# EAGLE design chrono (EAGLE 7.5.0)
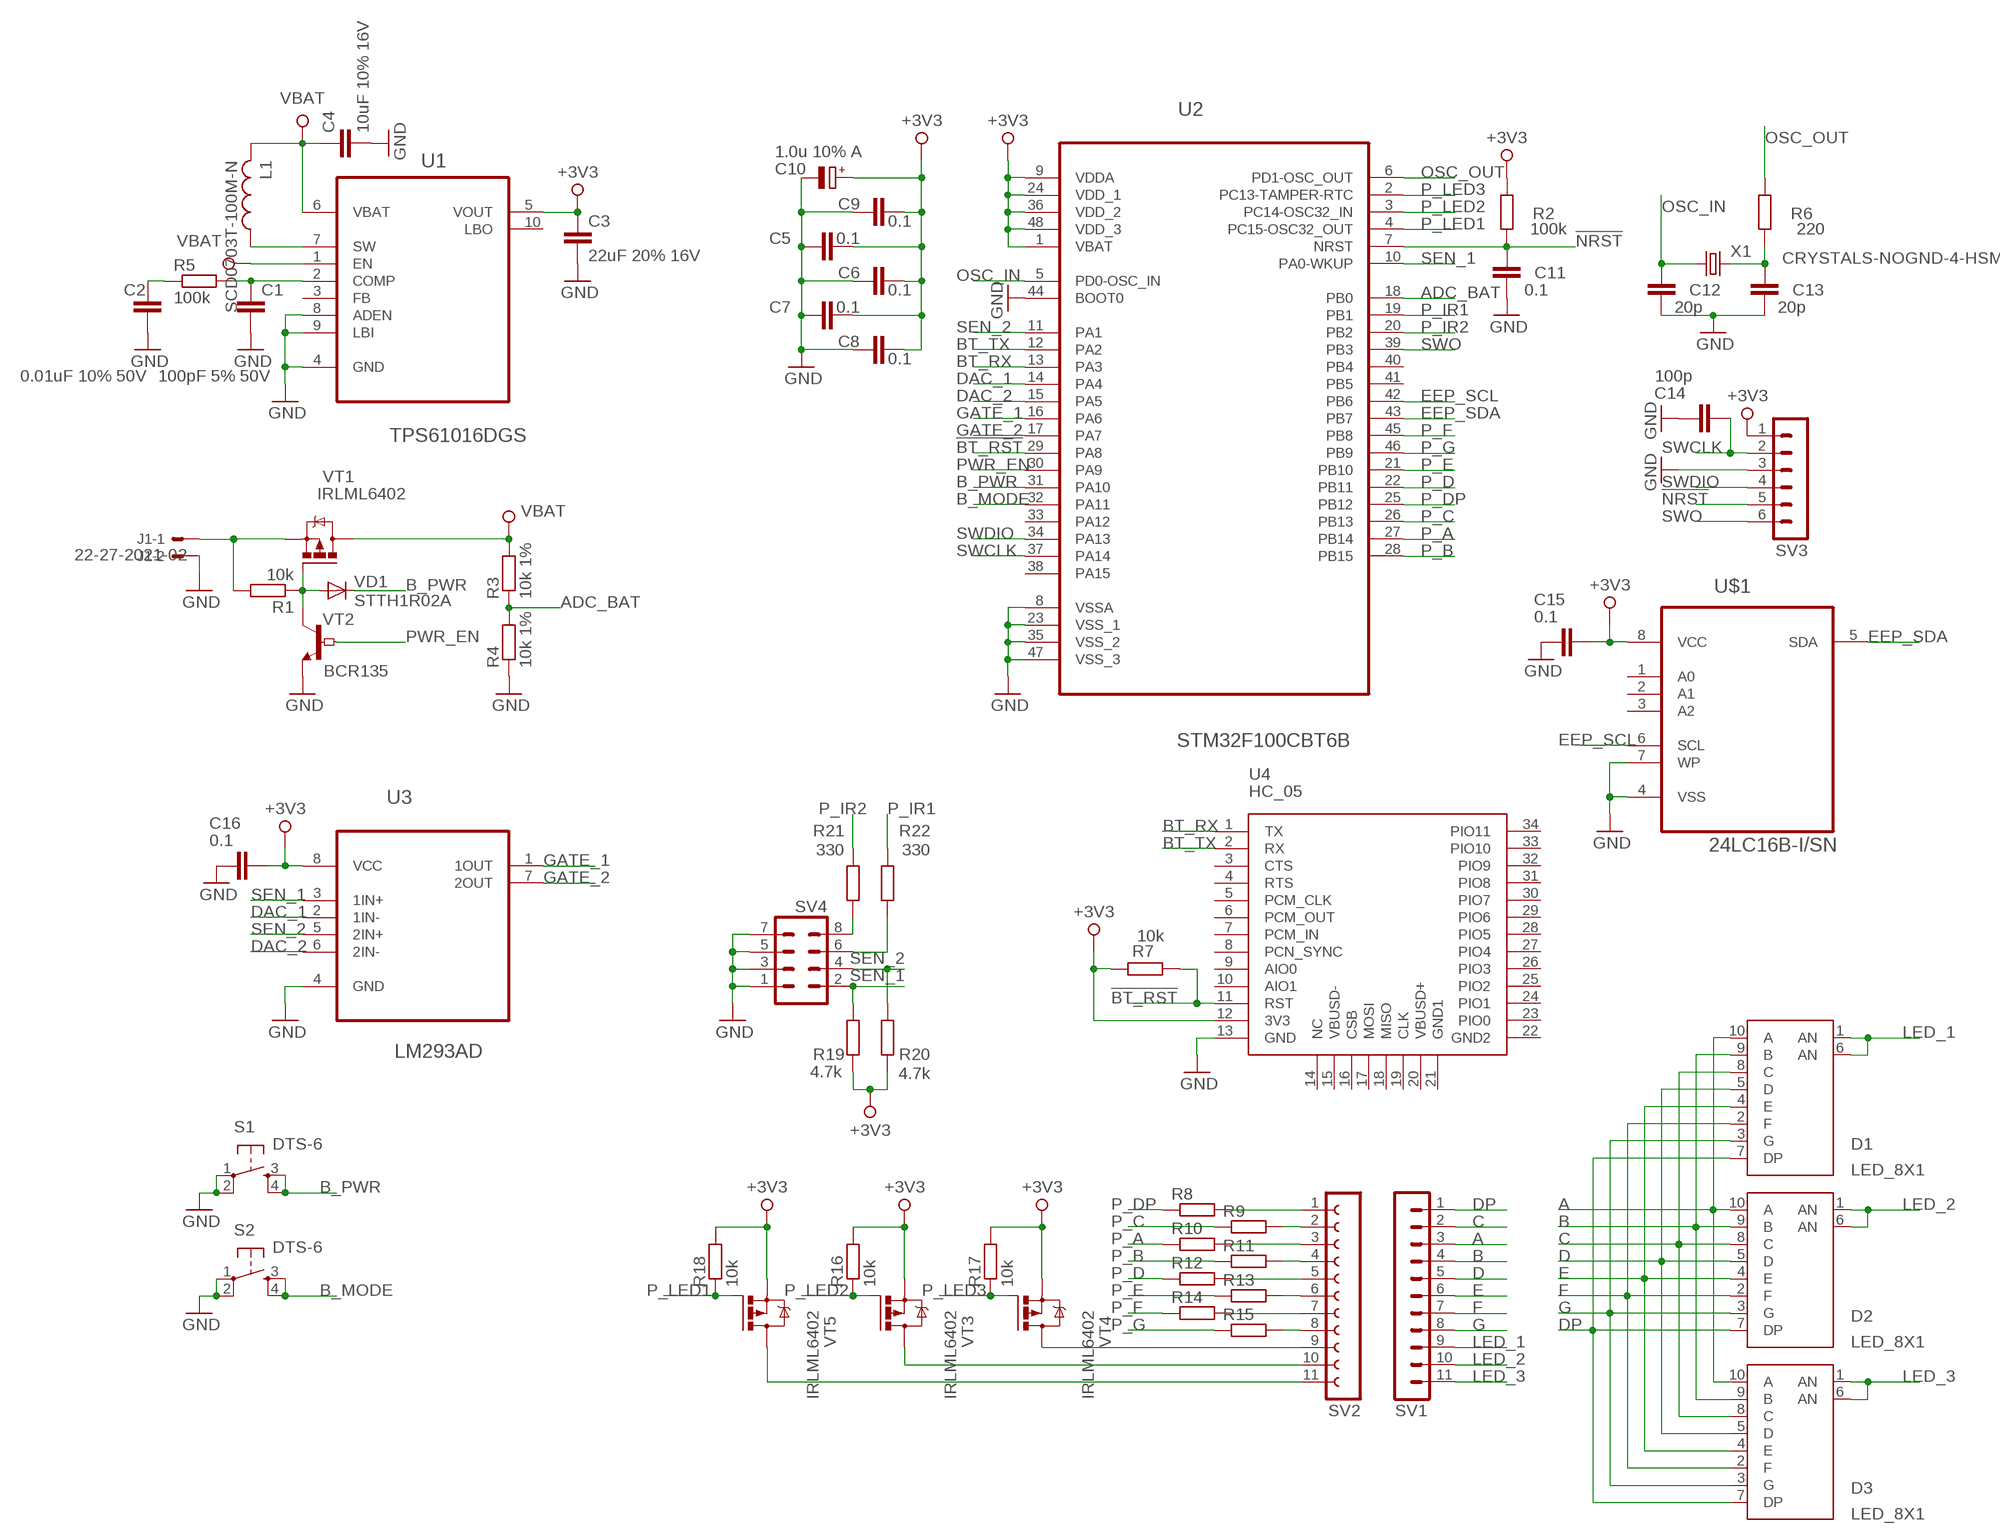
[diagram p0: schematic, sheet 1]

## Parts
C1  100pF 5% 50V  C-EUC0805  [C0805]
C2  0.01uF 10% 50V  C-EUC0805  [C0805]
C3  22uF 20% 16V  C-EUC1206  [C1206]
C4  10uF 10% 16V  C-EUC0805  [C0805]
C5  0.1  C-EUC0603  [C0603]
C6  0.1  C-EUC0603  [C0603]
C7  0.1  C-EUC0603  [C0603]
C8  0.1  C-EUC0603  [C0603]
C9  0.1  C-EUC0603  [C0603]
C10  1.0u 10% A  CPOL-EUSMCA  [SMC_A]
C11  0.1  C-EUC0603  [C0603]
C12  20p  C-EUC0603  [C0603]
C13  20p  C-EUC0603  [C0603]
C14  100p  C-EUC0603  [C0603]
C15  0.1  C-EUC0603  [C0603]
C16  0.1  C-EUC0603  [C0603]
D1  LED_8X1  [LED_DIP10]
D2  LED_8X1  [LED_DIP10]
D3  LED_8X1  [LED_DIP10]
J1  22-27-2021-02  [6410-02]
L1  SCD0703T-100M-N  L-US  [SCD0703]
R1  10k  R-EU_R0805  [R0805]
R2  100k  R-EU_R0603  [R0603]
R3  10k 1%  R-EU_R0603  [R0603]
R4  10k 1%  R-EU_R0603  [R0603]
R5  100k  R-EU_R0805  [R0805]
R6  220  R-EU_R0603  [R0603]
R7  10k  R-EU_R0603  [R0603]
R8  R-EU_R0603  [R0603]
R9  R-EU_R0603  [R0603]
R10  R-EU_R0603  [R0603]
R11  R-EU_R0603  [R0603]
R12  R-EU_R0603  [R0603]
R13  R-EU_R0603  [R0603]
R14  R-EU_R0603  [R0603]
R15  R-EU_R0603  [R0603]
R16  10k  R-EU_R0603  [R0603]
R17  10k  R-EU_R0603  [R0603]
R18  10k  R-EU_R0603  [R0603]
R19  4.7k  R-EU_R0603  [R0603]
R20  4.7k  R-EU_R0603  [R0603]
R21  330  R-EU_R0603  [R0603]
R22  330  R-EU_R0603  [R0603]
S1  DTS-6  [DTS-6]
S2  DTS-6  [DTS-6]
SV1  MA11-1W  [MA11-1W]
SV2  FE11-1  [FE11]
SV3  MA06-1  [MA06-1]
SV4  MA04-2  [MA04-2]
U1  TPS61016DGS  [SOP50P490X110-10N]
U2  STM32F100CBT6B  [QFP50P900X900X160-48N]
U3  LM293AD  [SOIC127P600X175-8N]
U4  HC_05  [BLUETOOTH_SMD]
U$1  24LC16B-I/SN  [SOIC127P600X175-8N]
VD1  STTH1R02A  VD-SMA  [SMA]
VT1  IRLML6402  [MICRO3]
VT2  BCR135  VT_NPN_DIGITAL  [SOT23-BEC]
VT3  IRLML6402  [MICRO3]
VT4  IRLML6402  [MICRO3]
VT5  IRLML6402  [MICRO3]
X1  CRYSTALS-NOGND-4-HSMX  [HC49-4-HSMX]

## Nets
!BT_RST: R7.2 U2.29(PA8) U4.11(RST)
!NRST: C11.1 R2.2 SV3.5 U2.7(NRST)
+3V3: C3.1 C5.2 C6.2 C7.2 C8.2 C9.1 C10.+ C15.2 C16.2 R2.1 R7.1 R16.2 R17.2 R18.2 R19.1 R20.1 SV3.1 U1.5(VOUT) U2.1(VBAT) U2.9(VDDA) U2.24(VDD_1) U2.36(VDD_2) U2.48(VDD_3) U3.8(VCC) U4.12(3V3) U$1.8(VCC) VT3.2(S) VT4.2(S) VT5.2(S)
A: D1.10(A) D2.10(A) D3.10(A) SV1.3
ADC_BAT: R3.1 R4.2 U2.18(PB0)
B: D1.9(B) D2.9(B) D3.9(B) SV1.4
B_MODE: S2.3 S2.4 U2.32(PA11)
B_PWR: S1.3 S1.4 U2.31(PA10) VD1.C
BT_RX: U2.13(PA3) U4.1(TX)
BT_TX: U2.12(PA2) U4.2(RX)
C: D1.8(C) D2.8(C) D3.8(C) SV1.2
D: D1.5(D) D2.5(D) D3.5(D) SV1.5
DAC_1: U2.14(PA4) U3.2(1IN-)
DAC_2: U2.15(PA5) U3.6(2IN-)
DP: D1.7(DP) D2.7(DP) D3.7(DP) SV1.1
E: D1.4(E) D2.4(E) D3.4(E) SV1.6
EEP_SCL: U2.42(PB6) U$1.6(SCL)
EEP_SDA: U2.43(PB7) U$1.5(SDA)
F: D1.2(F) D2.2(F) D3.2(F) SV1.7
G: D1.3(G) D2.3(G) D3.3(G) SV1.8
GATE_1: U2.16(PA6) U3.1(1OUT)
GATE_2: U2.17(PA7) U3.7(2OUT)
GND: C1.2 C2.2 C3.2 C4.2 C5.1 C6.1 C7.1 C8.1 C9.2 C10.- C11.2 C12.2 C13.2 C14.1 C15.1 C16.1 J1.2 R4.1 S1.1 S1.2 S2.1 S2.2 SV3.3 SV4.1 SV4.3 SV4.5 SV4.7 U1.4(GND) U1.8(ADEN) U1.9(LBI) U2.8(VSSA) U2.23(VSS_1) U2.35(VSS_2) U2.44(BOOT0) U2.47(VSS_3) U3.4(GND) U4.13(GND) U$1.4(VSS) U$1.7(WP) VT2.E
LED_1: D1.1(AN) D1.6(AN) SV1.9
LED_2: D2.1(AN) D2.6(AN) SV1.10
LED_3: D3.1(AN) D3.6(AN) SV1.11
N$1: J1.1 R1.2 VT1.2(S)
N$2: R1.1 VD1.A VT1.1(G) VT2.C
N$3: C1.1 R5.2 U1.2(COMP)
N$4: L1.P$1 U1.7(SW)
N$5: C2.1 R5.1
N$6: C13.1 R6.2 X1.2
N$7: R8.2 SV2.1
N$8: R9.2 SV2.2
N$9: R10.2 SV2.3
N$10: R11.2 SV2.4
N$21: R21.1 SV4.8
N$22: R12.2 SV2.5
N$23: R13.2 SV2.6
N$24: R14.2 SV2.7
N$25: R15.2 SV2.8
N$26: SV2.9 VT4.3(D)
N$27: SV2.10 VT3.3(D)
N$28: SV2.11 VT5.3(D)
N$29: R22.1 SV4.6
OSC_IN: C12.1 U2.5(PD0-OSC_IN) X1.1
OSC_OUT: R6.1 U2.6(PD1-OSC_OUT)
P_A: R10.1 U2.27(PB14)
P_B: R11.1 U2.28(PB15)
P_C: R9.1 U2.26(PB13)
P_D: R12.1 U2.22(PB11)
P_DP: R8.1 U2.25(PB12)
P_E: R13.1 U2.21(PB10)
P_F: R14.1 U2.45(PB8)
P_G: R15.1 U2.46(PB9)
P_IR1: R22.2 U2.19(PB1)
P_IR2: R21.2 U2.20(PB2)
P_LED1: R18.1 U2.4(PC15-OSC32_OUT) VT5.1(G)
P_LED2: R16.1 U2.3(PC14-OSC32_IN) VT3.1(G)
P_LED3: R17.1 U2.2(PC13-TAMPER-RTC) VT4.1(G)
PWR_EN: U2.30(PA9) VT2.B
SEN_1: R19.2 SV4.2 U2.10(PA0-WKUP) U3.3(1IN+)
SEN_2: R20.2 SV4.4 U2.11(PA1) U3.5(2IN+)
SWCLK: C14.2 SV3.2 U2.37(PA14)
SWDIO: SV3.4 U2.34(PA13)
SWO: SV3.6 U2.39(PB3)
VBAT: C4.1 L1.P$2 R3.2 U1.1(EN) U1.6(VBAT) VT1.3(D)
Unconnected: U1.3(FB) U1.10(LBO) U2.33(PA12) U2.38(PA15) U2.40(PB4) U2.41(PB5) U4.3(CTS) U4.4(RTS) U4.5(PCM_CLK) U4.6(PCM_OUT) U4.7(PCM_IN) U4.8(PCN_SYNC) U4.9(AIO0) U4.10(AIO1) U4.14(NC) U4.15(VBUSD-) U4.16(CSB) U4.17(MOSI) U4.18(MISO) U4.19(CLK) U4.20(VBUSD+) U4.21(GND1) U4.22(GND2) U4.23(PIO0) U4.24(PIO1) U4.25(PIO2) U4.26(PIO3) U4.27(PIO4) U4.28(PIO5) U4.29(PIO6) U4.30(PIO7) U4.31(PIO8) U4.32(PIO9) U4.33(PIO10) U4.34(PIO11) U$1.1(A0) U$1.2(A1) U$1.3(A2)

## Library data of the parts
C1-C9 C11-C16 = rcl:C-EU: CAPACITOR, European symbol
C10 = rcl:CPOL-EU: POLARIZED CAPACITOR, European symbol
D1-D3 = chrono:LED_8X1: edit this description Auto generated by make-symbol-device-package-bsdl.ulp Rev. 44 Source:
J1 = con-molex:22-?-02: CONNECTOR wire to board 2.54 mm (.1 inch) pitch header; OC_FARNELL: unknown; OC_NEWARK: unknown
L1 = chrono:L-US: INDUCTOR, American symbol
R1-R22 = rcl:R-EU_: RESISTOR, European symbol
S1 S2 = switch-tact:DTS-6
SV1 = chrono:MA11-1W: PIN HEADER; OC_FARNELL: unknown; OC_NEWARK: unknown
SV2 = chrono:FE11-1: FEMALE HEADER; OC_FARNELL: unknown; OC_NEWARK: unknown
SV3 = con-lstb:MA06-1: PIN HEADER; OC_FARNELL: unknown; OC_NEWARK: unknown
SV4 = con-lstb:MA04-2: PIN HEADER; OC_FARNELL: unknown; OC_NEWARK: unknown
U1 = Texas Instruments_By_element14_Batch_1:TPS61016DGS: 1-CELL AND 2-CELL BOOST CONVERTERS; MPN: TPS61016DGS; OC_FARNELL: 8457816; OC_NEWARK: 77C0668; PACKAGE: MSOP-10; SUPPLIER: Texas Instruments
U2 = ST Microelctronics_By_element14_Batch_1:STM32F100CBT6B: ARM-based 32-bit MCU; MPN: STM32F100CBT6B; OC_FARNELL: 1838512; OC_NEWARK: 86R1308; PACKAGE: LQFP-48; SUPPLIER: STMircroelectronics
U3 = Texas Instruments_By_element14_Batch_1:LM293AD: DUAL DIFFERENTIAL COMPARATORS; MPN: LM293AD; OC_FARNELL: 8389225; OC_NEWARK: 38K3696; PACKAGE: SOIC-8; SUPPLIER: TI
U4 = SerialPortBluetooth:HC_05
U$1 = Microchip_By_element14_Batch_1:24LC16B-I/SN: 16K I2C Serial EEPROM; MPN: 24LC16B-I/SN; OC_FARNELL: 1296575; OC_NEWARK: 69K7670; PACKAGE: SOIC-8; SUPPLIER: MICROCHIP
VD1 = walkgeek-eagle:VD-SMA
VT1 VT3-VT5 = walkgeek-eagle:IRLML6402: HEXFET P-Channel Power MOSFET
VT2 = walkgeek-eagle:VT_NPN_DIGITAL
X1 = IQD-Frequency-Products:CRYSTALS-NOGND: CRYSTALS CAN NOT GROUNDED

## Board
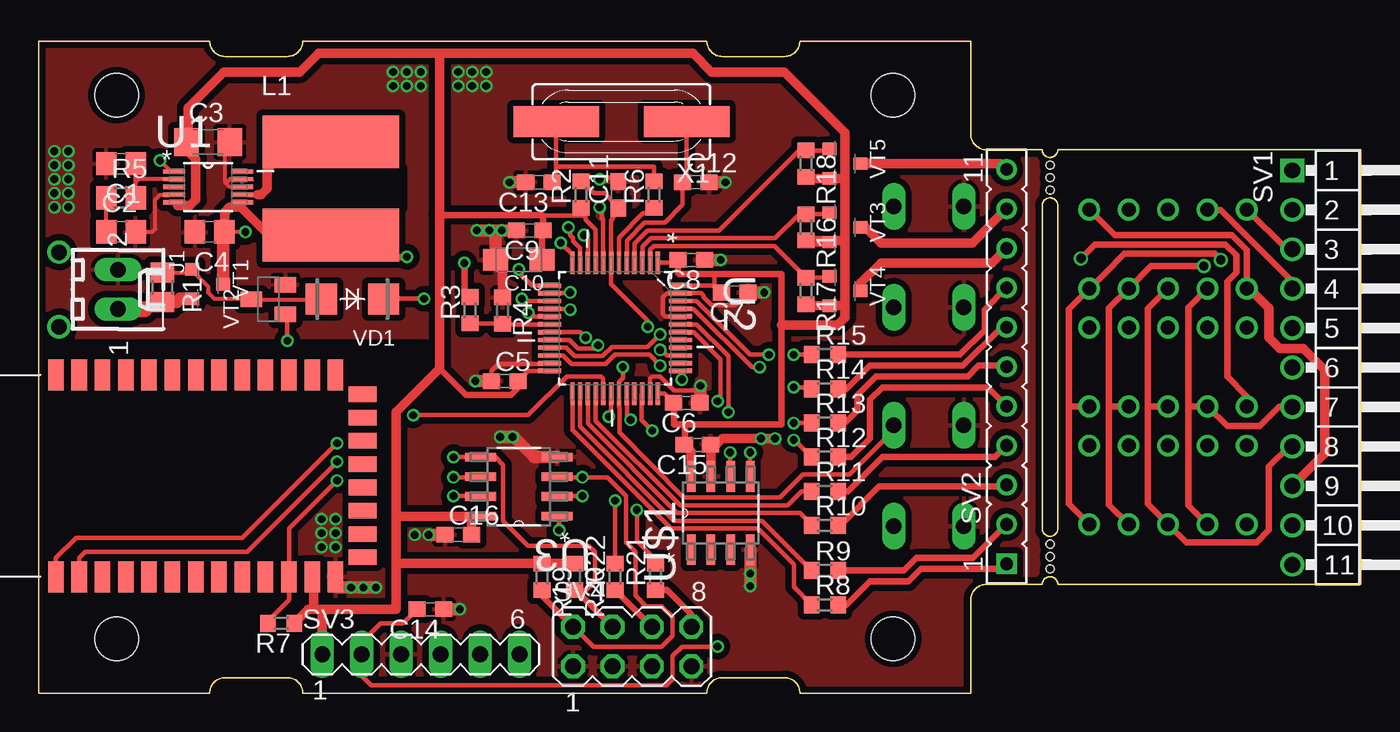
[diagram p1: board, top side]
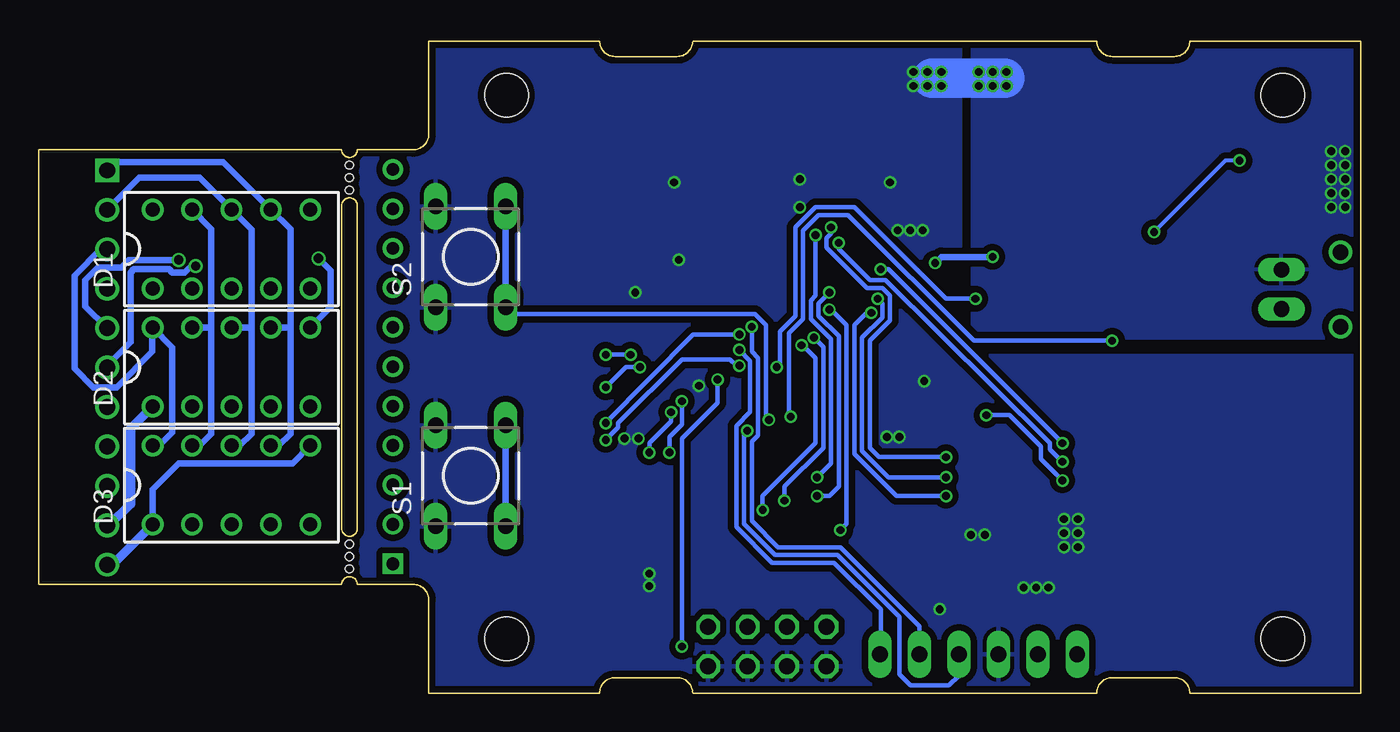
[diagram p2: board, bottom side, seen from below]

Size 85.1 x 42 mm. Coordinates in mm from the lower left corner, seen from the top.
Outline: 64.6,31.4 64.6,10.6 arc180 65.6,10.6 65.6,31.4 arc180 64.6,31.4
Outline: 0,0 0,42 11,42 arc90 12,41 16,41 arc90 17,42 43,42 arc90 44,41 48,41 arc90 49,42 60,42 60,36 arc90 61,35 64.6,35 arc180 65.6,35 85.1,35 85.1,7 65.6,7 arc180 64.6,7 61,7 arc90 60,6 60,0 49,0 arc90 48,1 44,1 arc90 43,0 17,0 arc90 16,1 12,1 arc90 11,0 0,0
Copper layers (1*16): Top 0.035mm / dielectric 1.5mm / Bottom 0.035mm
Design rules "dirt_cheap_dirty_boards.v1": minimum track width 5mil, minimum drill 12mil, track to track 5mil, track to pad 5mil, pad to pad 5mil, via to via 5mil, smd to smd 0mil, copper to edge 10mil, drill to drill 10mil, minimum pad ring 10mil, minimum via ring 6mil, stop-mask expansion 2mil, vias tented up to drill 25mil, thermal gap 10mil
Holes 2.8 mm at 5,38.5 5,3.5 55,38.5 55,3.5
Holes 0.5 mm at 65.1,34 65.1,33.2 65.1,32.4 65.1,8 65.1,8.8 65.1,9.6

### Footprints (pad centres in the part's own frame; a part is rotated, then mirrored left to right if it is on the bottom)
C0805 = smd 1.3 x 1.5: 1 -0.95,0; 2 0.95,0
C1206 = smd 1.6 x 1.8: 1 -1.4,0; 2 1.4,0
C0603 = smd 1.1 x 1: 1 -0.85,0; 2 0.85,0
SMC_A = smd 1.6 x 1.4: + -1.5,0; - 1.5,0
LED_DIP10 = drill 0.9 pad 1.4: 1 -2.54,5.08; 2 -2.54,2.54; 3 -2.54,0; 4 -2.54,-2.54; 5 -2.54,-5.08; 6 2.54,-5.08; 7 2.54,-2.54; 8 2.54,0; 9 2.54,2.54; 10 2.54,5.08
6410-02 = drill 1.016 long: 1 1.27,0; 2 -1.27,0
SCD0703 = smd 8.8 x 3.4: P$1 0,3; P$2 0,-3
R0805 = smd 1.3 x 1.5: 1 -0.95,0; 2 0.95,0
R0603 = smd 1 x 1.1: 1 -0.85,0; 2 0.85,0
DTS-6 = drill 1 long: 1 -3.25,2.25; 2 3.25,2.25; 3 -3.25,-2.25; 4 3.25,-2.25
MA11-1W = drill 1.016 square: 1 -13.97,0 | drill 1.016: 2 -11.43,0; 3 -8.89,0; 4 -6.35,0; 5 -3.81,0; 6 -1.27,0; 7 1.27,0; 8 3.81,0; 9 6.35,0; 10 8.89,0; 11 11.43,0
FE11 = drill 0.813 square: 1 -13.97,0 | drill 0.813: 2 -11.43,0; 3 -8.89,0; 4 -6.35,0; 5 -3.81,0; 6 -1.27,0; 7 1.27,0; 8 3.81,0; 9 6.35,0; 10 8.89,0; 11 11.43,0
MA06-1 = drill 1.016 long: 1 -6.35,0; 2 -3.81,0; 3 -1.27,0; 4 1.27,0; 5 3.81,0; 6 6.35,0
MA04-2 = drill 1.016 octagon: 1 -3.81,-1.27; 2 -3.81,1.27; 3 -1.27,-1.27; 4 -1.27,1.27; 5 1.27,-1.27; 6 1.27,1.27; 7 3.81,-1.27; 8 3.81,1.27
SOP50P490X110-10N = smd 1.422 x 0.279: 1 -2.184,0.991; 2 -2.184,0.508; 3 -2.184,0; 4 -2.184,-0.508; 5 -2.184,-0.991; 6 2.184,-0.991; 7 2.184,-0.508; 8 2.184,0; 9 2.184,0.508; 10 2.184,0.991
QFP50P900X900X160-48N = smd 1.473 x 0.279: 1 -4.216,2.743; 2 -4.216,2.261; 3 -4.216,1.753; 4 -4.216,1.245; 5 -4.216,0.762; 6 -4.216,0.254; 7 -4.216,-0.254; 8 -4.216,-0.762; 9 -4.216,-1.245; 10 -4.216,-1.753; 11 -4.216,-2.261; 12 -4.216,-2.743; 25 4.216,-2.743; 26 4.216,-2.261; 27 4.216,-1.753; 28 4.216,-1.245; 29 4.216,-0.762; 30 4.216,-0.254; 31 4.216,0.254; 32 4.216,0.762; 33 4.216,1.245; 34 4.216,1.753; 35 4.216,2.261; 36 4.216,2.743 | smd 0.279 x 1.473: 13 -2.743,-4.216; 14 -2.261,-4.216; 15 -1.753,-4.216; 16 -1.245,-4.216; 17 -0.762,-4.216; 18 -0.254,-4.216; 19 0.254,-4.216; 20 0.762,-4.216; 21 1.245,-4.216; 22 1.753,-4.216; 23 2.261,-4.216; 24 2.743,-4.216; 37 2.743,4.216; 38 2.261,4.216; 39 1.753,4.216; 40 1.245,4.216; 41 0.762,4.216; 42 0.254,4.216; 43 -0.254,4.216; 44 -0.762,4.216; 45 -1.245,4.216; 46 -1.753,4.216; 47 -2.261,4.216; 48 -2.743,4.216
SOIC127P600X175-8N = smd 1.981 x 0.559: 1 -2.464,1.905; 2 -2.464,0.635; 3 -2.464,-0.635; 4 -2.464,-1.905; 5 2.464,-1.905; 6 2.464,-0.635; 7 2.464,0.635; 8 2.464,1.905
BLUETOOTH_SMD = smd 2 x 1: 1 0,0; 2 0,-1.5; 3 0,-3; 4 0,-4.5; 5 0,-6; 6 0,-7.5; 7 0,-9; 8 0,-10.5; 9 0,-12; 10 0,-13.5; 11 0,-15; 12 0,-16.5; 13 0,-18; 22 13,-18; 23 13,-16.5; 24 13,-15; 25 13,-13.5; 26 13,-12; 27 13,-10.5; 28 13,-9; 29 13,-7.5; 30 13,-6; 31 13,-4.5; 32 13,-3; 33 13,-1.5; 34 13,0 | smd 1 x 1.8: 14 1.25,-19.75; 15 2.75,-19.75; 16 4.25,-19.75; 17 5.75,-19.75; 18 7.25,-19.75; 19 8.75,-19.75; 20 10.25,-19.75; 21 11.75,-19.75
SOIC127P600X175-8N' = smd 1.981 x 0.559: 1 -2.362,1.905; 2 -2.362,0.635; 3 -2.362,-0.635; 4 -2.362,-1.905; 5 2.362,-1.905; 6 2.362,-0.635; 7 2.362,0.635; 8 2.362,1.905
SMA = smd 2 x 2: A 2,0; C -2,0
MICRO3 = smd 0.8 x 0.9: 1 -0.95,-1; 2 0.95,-1; 3 0,1
SOT23-BEC = smd 1 x 1.4: B -0.95,-1.1; C 0,1.1; E 0.95,-1.1
HC49-4-HSMX = smd 5.5 x 2: 1 -4.2,0; 2 4.2,0

### Placement (x,y rotation side)
C1  5.3,34.1 180 top
C2  5.3,29.7 0 top
C3  10.9,35.5 0 top
C4  11,29.7 180 top
C5  30,20.1 0 top
C6  41.7,18.7 180 top
C7  44.8,25.8 180 top
C8  42,27.9 180 top
C9  31.6,29.8 180 top
C10  30.9,27.9 180 top
C11  37.3,32.1 90 top
C12  42.3,32.9 0 top
C13  32.2,32.9 180 top
C14  25.2,5.4 180 top
C15  42.4,16 180 top
C16  27,10.2 0 top
D1  72.7,28.6 90 bottom
D2  72.7,21 90 bottom
D3  72.7,13.4 90 bottom
J1  5.1,26 270 top
L1  18.8,32.5 0 top
R1  7.95,26.14 270 top
R2  34.9,32.1 90 top
R3  27.76,24.66 90 top
R4  29.86,24.64 270 top
R5  5.3,31.9 0 top
R6  39.6,32.1 90 top
R7  15.6,4.5 180 top
R8  50.6,5.7 0 top
R9  50.6,7.9 0 top
R10  50.6,10.8 0 top
R11  50.6,13 0 top
R12  50.6,15.2 0 top
R13  50.6,17.4 0 top
R14  50.6,19.6 0 top
R15  50.6,21.8 0 top
R16  49.4,30 270 top
R17  49.4,25.9 270 top
R18  49.4,34.1 270 top
R19  32.4,7.5 270 top
R20  34.5,7.5 270 top
R21  39.7,7.5 90 top
R22  37.1,7.5 90 top
S1  57.3,14 90 bottom
S2  57.3,28.1 90 bottom
SV1  80.7,19.7 270 top
SV2  62.3,22.3 90 top
SV3  24.6,2.5 0 top
SV4  38.2,3 0 top
U1  10.9,32.6 0 top
U2  37.1,23.5 270 top
U3  30.9,13.3 180 top
U4  1.1,7.5 90 top
U$1  24LC16B-I/SN  [SOIC127P600X175-8N']  43.9,11.6 90 top
VD1  20.19,25.38 180 top
VT1  10.88,26.34 270 top
VT2  14.78,25.36 90 top
VT3  51.9,30 270 top
VT4  51.9,25.9 270 top
VT5  51.9,34.1 270 top
X1  37.5,36.8 180 top

### Tracks (layer width: path | path; a pad name or v marks a point on that pad's centre or on a via)
!BT_RST  (via drill 0.5)
  Top 0.305: U2.29 36.34,20.26 36.2,20.4 34,20.4 31.5,17.9 v24.1,17.9 | v19.2,13.7 16.1,10.6 U4.11 16.1,6 14.75,4.65 R7.2
  Bottom 0.305: v24.1,17.9 22.6,17.9 20.6,15.9 20.6,15.1 v19.2,13.7
!NRST  (via drill 0.5)
  Top 0.305: R2.2 35.75,32.2 36.5,32.2 37.3,31.1 C11.1 36.85,30.4 U2.7 36.85,26.35 39.2,24 v39.2,23.6
  Bottom 0.305: SV3.5 28.41,4.31 33.5,9.4 37.5,9.4 39.2,11.1 39.2,16.2 38.8,16.6 38.8,21.6 39.2,22 v39.2,23.6
+3V3
  Top 0.254: U1.5 8.93,31.4
  Top 0.305: U2.9 35.85,29.84 35.2,30.5 35.2,30.7 | U2.1 40.97,27.72 C8.2 | U2.24 31.51,20.76 C5.2 | 35.2,30.7 35.2,30.95 R2.1 | 32.45,30.75 35.15,30.75 35.2,30.7 | U2.36 40.27,19.28 C6.2 | 43.6,26.15 C7.2 43.51,26.24 U2.48 43.46,26.24 43.5,26.2 43.5,27
  Top 0.406: 41.4,17.3 47.8,17.3 47.8,23.7 47.8,27 43.5,27 41.2,27 41.15,27.05 C8.2 | 41.4,17.3 40.9,17.3 40.9,18.65 | C10.+ 32.4,29.75 C9.1 32.45,30.75 32.4,30.8 25.8,30.8 25.8,30.9 | 41.6,16.05 41.6,17.1 41.4,17.3 | 25.8,20.9 27.5,19.2 30.4,19.2 30.85,19.65 C5.2
  Top 0.61: 8.93,31.4 9.7,31.4 10.1,31.8 10.1,34.4 9.5,35 C3.1 9.6,35.6 9.6,37.7 11.9,40 16.8,40 18,41.2 25.8,41.2 | 25.8,41.2 42.1,41.2 43.3,40 48,40 51.9,36.1 51.9,33.2 | 25.8,41.2 25.8,30.9 25.8,20.9 23,18.1 23,11.6 | 23,11.6 23,8.3 | 23,8.3 23,5.4 18.1,5.4 | 18.1,5.4 17.7,5.4 | 17.7,5.4 17.7,7.4 U4.12 | VT3.2 49.5,29.05 R16.2 51.65,29.15 51.9,28.9 | R18.2 49.5,33.15 VT5.2 51.85,33.15 51.9,33.2 | R17.2 49.5,24.95 VT4.2 51.85,24.95 51.9,25 | SV3.1 18.25,5.25 18.1,5.4 | 17.7,5.4 17.35,5.4 R7.1 | 51.9,33.2 51.9,28.9 | 51.9,28.9 51.9,25 | 51.9,25 51.9,24.2 51.4,23.7 47.8,23.7 | U3.8 27.7,11.39 | 23,8.3 23.05,8.35 R19.1 R20.1 | 40.9,18.65 C6.2 | 41.6,16.05 C15.2 41.99,15.55 U$1.8 | C16.2 27.85,11.24 27.7,11.39 | 27.7,11.39 23.2,11.39 23,11.6
A
  Top 0.406: 77.8,23.52 D2.10 | SV1.3 80.33,28.59 D1.10
  Bottom 0.406: D3.10 77.36,15.94 76.5,16.8 76.5,22.26 D2.10 77.8,23.52 77.8,22 80.1,19.7 81.6,19.7 82.8,20.9 82.8,26.9 81.11,28.59 SV1.3
ADC_BAT
  Top 0.305: U2.18 29.9,23.75 R4.2 27.78,23.79 R3.1
B
  Top 0.406: D1.9 75.28,31.1 76.1,31.1 80.7,26.5 SV1.4
  Bottom 0.406: D3.9 74.76,15.94 74,16.7 74,23.5 | 74,23.5 74,29.9 D1.9 | D2.9 74.04,23.54 74,23.5
B_MODE  (via drill 0.5)
  Top 0.305: U2.32 37.86,17.86 v38.1,17.6
  Bottom 0.305: v38.1,17.6 38.3,17.8 38.3,23.7 39,24.4 54.6,24.4 S2.3
  Bottom 0.406: S2.3 S2.4
B_PWR  (via drill 0.5)
  Top 0.305: S1.4 55.05,16.95 52.2,14.1 49.2,14.1 47.7,12.6 41.5,12.6 37.4,16.8 37.4,18.4 37.35,18.45 U2.31 37.35,20.05 37.6,20.3 v37.6,21 | v24.8,25.4 22.21,25.4 VD1.C
  Bottom 0.305: v37.6,21 37.4,21.2 37.4,23.3 36.4,24.3 36.4,30 35.1,31.3 32.6,31.3 26.7,25.4 v24.8,25.4
  Bottom 0.406: S1.3 S1.4
BT_RX  (via drill 0.5)
  Top 0.305: U2.13 31.76,26.24 30.9,27.1 v30.9,27.3 | U4.1 1.1,8.7 2.4,10 13.1,10 v19.2,16.1
  Bottom 0.305: 30.6,27.3 v30.9,27.3 30.4,27.3 v19.2,16.1
BT_TX  (via drill 0.5)
  Top 0.305: U2.12 34.36,28.24 v33.6,29 | 2.7,7.6 U4.2 2.6,8.7 3,9.1 13.4,9.1 v19.2,14.9
  Bottom 0.305: v33.6,29 33.6,28.6 31.6,26.6 30.6,26.6 20.1,16.2 20,16.1 20,15.7 v19.2,14.9
C
  Bottom 0.406: D3.8 72.16,15.94 71.4,16.7 71.4,23.4 | 71.4,23.4 71.4,29.84 D1.8 74.76,33.2 78.63,33.2 SV1.2 | D2.8 71.54,23.54 71.4,23.4
D  (via drill 0.6)
  Top 0.406: 66.3,18.4 66.3,24.74 D1.5 68.62,27.02 69.9,28.3 75.7,28.3 v76.1,27.9 | D2.5 66.36,18.46 66.3,18.4 | 66.3,18.4 66.3,12.18 D3.5
  Bottom 0.406: v76.1,27.9 79.3,27.9 79.8,27.4 81.3,27.4 82.1,26.6 82.1,24.91 SV1.5
DAC_1  (via drill 0.5)
  Top 0.305: U2.14 34.16,25.76 v34.2,25.8 | v35,12.7 33.4,12.7 U3.2
  Bottom 0.305: v34.2,25.8 34.9,25.1 34.9,24.3 33.6,23 33.6,13.3 34.2,12.7 v35,12.7
DAC_2  (via drill 0.5)
  Top 0.305: U2.15 31.25,25.25 v31.1,25.4 | v26.7,13.9 28.4,13.9 U3.6
  Bottom 0.305: v26.7,13.9 30.4,13.9 32.1,15.6 32.1,22.9 30.8,24.2 30.8,25.1 v31.1,25.4
DP
  Bottom 0.406: D3.7 69.66,15.94 68.9,16.7 68.9,23.4 | 68.9,23.4 68.9,29.88 D1.7 73.22,34.2 80.17,34.2 SV1.1 | D2.7 69.04,23.54 68.9,23.4
E  (via drill 0.6)
  Top 0.406: 68.9,18.5 68.9,24.8 D1.4 71.6,27.5 v75,27.5 | D2.4 68.94,18.46 68.9,18.5 | 68.9,18.5 68.9,12.12 D3.4
  Bottom 0.406: SV1.6 80.7,21.1 79.2,22.6 79.2,27.1 79,27.3 76.7,27.3 76.5,27.1 75.7,27.1 75.3,27.5 v75,27.5 75.1,27.5
EEP_SCL  (via drill 0.5)
  Top 0.305: U2.42 42.15,23.25 43.9,21.5 43.9,19 v43.7,18.8 | v44.5,15.5 44.5,14 U$1.6
  Bottom 0.305: v43.7,18.8 43.7,17.3 44.5,16.5 v44.5,15.5
EEP_SDA  (via drill 0.5)
  Top 0.305: U2.43 42.35,23.75 44.4,21.7 v44.4,18.1 | v45.8,15.5 U$1.5
  Bottom 0.305: 44.4,17.9 v44.4,18.1 44.4,17.5 45.8,16.1 v45.8,15.5
F
  Top 0.406: 74,18.3 74,24.82 D1.2 | 74,18.3 74.16,18.46 D2.2 76.5,17.2 78.6,17.2 79.83,18.43 SV1.7 | 74,18.3 74,12.1 D3.2
G
  Top 0.406: 71.4,18.3 71.4,12.2 72.7,10.9 D3.3 73.86,9.7 78.4,9.7 79.2,10.5 79.2,14.6 80.49,15.89 SV1.8 | 71.4,18.3 71.4,24.76 D1.3 | D2.3 71.56,18.46 71.4,18.3
GATE_1  (via drill 0.5)
  Top 0.305: U2.16 34.16,24.75 v34.2,24.7 | v33.5,10.5 33.5,11.26 U3.1
  Bottom 0.305: v34.2,24.7 34.1,24.7 33.1,23.7 33.1,10.9 v33.5,10.5
GATE_2  (via drill 0.5)
  Top 0.305: U2.17 31.74,24.26 v31.5,24.5 | v26.7,12.7 28.4,12.7 U3.7
  Bottom 0.305: v31.5,24.5 31.8,24.5 32.6,23.7 32.6,15.4 29.9,12.7 v26.7,12.7
GND  (via drill 0.5)
  Top 0.254: 11.9,35.1 C3.2 12,35.2 12,32.9 12.05,32.85 | C2.2 7.3,29.7 7.5,29.9 7.5,31.8 7.8,32.1 8.71,32.1 U1.4 | U1.8 12.3,32.6 12.05,32.85 | U1.9 12.31,33.11 12.05,32.85
  Top 0.305: U2.8 36.34,30.54 36.26,30.54 36.26,31.14 v36.1,31.3 | 37.45,32.95 C11.2 37.25,33.2 36.2,33.2 v36.1,33.1 | U2.44 40.34,24.26 40.2,24.4 40.2,25.5 40.46,25.76 U2.47 42.64,25.76 42.8,25.6 42.8,25.5 43.3,25 44.85,25 C7.1 | U2.23 32.84,21.2 29.6,21.2 29.15,20.75 C5.1 | U2.35 39.36,20.26 39.5,20.4 40,20.4 40.9,19.5 42.3,19.5 v42.6,19.8
  Top 0.61: R4.1 29.86,27.44 C10.- | U$1.7 43.27,15.98 C15.1 43.6,16 44,16.4 v46.5,16.4 v47.4,16.4 47.5,16.4 | C6.1 42.55,19.75 v42.6,19.8 | U4.13 19,7.5 18.9,7.4 18.9,7.2 19.3,6.8
  Top 0.813: 19.3,6.8 v20.1,6.8 v20.9,6.8 v21.7,6.8 | C10.- 29.4,29.7 29.5,29.8 v29.8,29.8 | C9.2 v29.8,29.8 | v29.8,29.8 v29,29.8 v28.2,29.8 | C13.2 v30.3,32.9 | C12.2 v44.2,32.9 | C8.1 v43.9,27.9 | 45.6,25.8 v46.7,25.8 | C6.1 42.6,18.75 v42.6,19.8 | C16.1 v25.1,10.2 | C14.1 v27.1,5.4 | C5.1 v28.1,20.1 | U$1.4 v45.8,6.91 v45.8,6.9 | U3.4 31.9,15.21 30.6,16.5 v30.5,16.5 v29.7,16.5
  Bottom 2.54: 22.9,39.6 27.6,39.6
  other vias: 45.8,7.7 22.8,40 23.7,40 24.6,40 22.8,39.1 23.7,39.1 24.6,39.1 27,40 27.9,40 28.8,40 27,39.1 27.9,39.1 28.8,39.1 1,34.9 1,34 1,33.1 1,32.2 1,31.3 1.9,34.9 1.9,34 1.9,33.1 1.9,32.2 1.9,31.3 19.1,9.4 19.1,10.3 19.1,11.2 18.2,11.2 18.2,10.3 18.2,9.4 24.2,10.2
  pour Bottom (isolate 0.406): 0.1,41.8 25,41.8 25,22.9 0.2,22.9
  pour Top (isolate 0.406): 0.1,41.8 25,41.8 25,22.9 0.2,22.9
  pour Bottom (isolate 0.406): 25.8,42 64.5,42 64.5,0 0.1,0 0.1,21.7 25.8,21.7
  pour Top (isolate 0.406): 25.5,42 64.5,42 64.5,0 0.1,0 0.1,21.7 25.5,21.7
  pour Top (isolate 0.406): 25.7,42 64.5,42 64.5,0 0.1,0 0.1,21.7 25.7,21.7
LED_1
  Top 0.406: D1.6 69.26,29.5 76.8,29.5 77.78,28.52 D1.1 77.94,26.06
  Top 0.61: 77.94,26.06 79.2,24.8 79.2,22.9 79.9,22.2 81.4,22.2 82.8,20.8 82.8,15.45 SV1.9
LED_2  (via drill 0.6)
  Top 0.406: D2.1 77.78,19.12 76.5,20.4 76.5,26.5 77.1,27.1 77.1,28.2 76.4,28.9 68,28.9 v67.1,28
  Bottom 0.406: v67.1,28 66.3,27.2 66.3,24.86 D2.6 | SV1.10 80.59,10.81
  Bottom 0.61: 80.59,10.81 79.2,12.2 79.2,17.04 D2.1
LED_3
  Bottom 0.406: D3.1 77.78,13.12 76.1,14.8 68.76,14.8 D3.6
  Bottom 0.61: SV1.11 80.37,8.27 D3.1
N$1
  Top 0.813: 6.81,24.71 7.3,25.2 R1.2 8.89,25.19 9.1,25.4 VT1.2
  Top 1.016: J1.1 6.79,24.73 6.81,24.71
N$2
  Top 0.254: R1.1 9.68,27.09 VT1.1 9.88,27.22 10.9,26.2 10.9,25.8 11.3,25.4 13.64,25.4 VT2.C 18.17,25.36 VD1.A
N$3
  Top 0.254: R5.2 6.25,32.9 | 6.25,32.9 C1.1 | 6.25,32.9 6.46,33.11 U1.2
N$4
  Top 0.254: 14.1,32.1 13.09,32.1 U1.7
  Top 0.61: L1.P$1 16.5,35.5 14.7,33.7 14.7,32.5 14.3,32.1 14.1,32.1
N$5
  Top 0.254: C2.1 R5.1
N$6
  Top 0.305: X1.2 33.3,33.8 | 33.3,33.8 33.3,32.85 C13.1 | R6.2 39.6,33.9 33.4,33.9 33.3,33.8
N$7
  Top 0.406: R8.2 52,5.7 53.5,7.2 56,7.2 56.8,8 61.97,8 SV2.1
N$8
  Top 0.406: R9.2 55.7,7.9 56.5,8.7 60.13,8.7 SV2.2
N$9
  Top 0.406: R10.2 51.6,10.8 54.1,13.3 62.19,13.3 SV2.3
N$10
  Top 0.406: R11.2 52.1,13 54.3,15.2 61.55,15.2 SV2.4
N$19  (via drill 1)
  other vias: 1.3,23.6
N$20  (via drill 1)
  other vias: 1.3,28.4
N$21
  Top 0.406: 39.63,6.65 R21.1 40.45,6.65 42,5.1 SV4.8
N$22
  Top 0.406: R12.2 52.3,15.2 53.5,16.4 53.5,18.9 54.3,19.7 61.09,19.7 SV2.5
N$23
  Top 0.406: SV2.6 62.23,21.1 60.5,21.1 59.8,20.4 53.9,20.4 52.7,19.2 52.7,18.2 52,17.5 51.5,17.5 51.45,17.45 R13.2
N$24
  Top 0.406: SV2.7 62.13,23.4 61.8,23.4 59.5,21.1 53.5,21.1 52,19.6 R14.2
N$25
  Top 0.406: R15.2 59.3,21.8 60.9,23.4 60.9,24.71 SV2.8
N$26
  Top 0.61: VT4.3 52.9,26.4 54.2,27.7 61.35,27.7 SV2.9
N$27
  Top 0.61: VT3.3 53.2,30 54.2,29 60.11,29 SV2.10
N$28
  Top 0.61: VT5.3 61.93,34.1 SV2.11
N$29
  Top 0.406: SV4.6 R22.1
OSC_IN
  Top 0.305: U2.5 37.86,29.16 39,30.3 40.3,30.3 41.45,31.45 C12.1 41.7,32.75 X1.1
OSC_OUT
  Top 0.305: U2.6 37.35,29.35 38.9,30.9 39.25,30.9 R6.1 39.65,30.9
P_A
  Top 0.305: U2.27 35.35,17.35 41.1,11.6 49,11.6 49.8,10.8 R10.1
P_B
  Top 0.305: U2.28 35.85,17.55 41.3,12.1 48.2,12.1 49.1,13 R11.1
P_C
  Top 0.305: U2.26 34.84,17.16 40.9,11.1 46.55,11.1 R9.1
P_D  (via drill 0.5)
  Top 0.305: U2.22 33.75,21.75 34.3,21.2 36.5,21.2 37.1,21.8 39.3,21.8 v40,21.1 | v48.6,16.3 48.65,16.3 R12.1
  Bottom 0.305: v48.6,16.3 47.8,17.1 47.8,17.4 43.7,21.5 40.6,21.5 40.2,21.1 v40,21.1
P_DP
  Top 0.305: U2.25 34.36,16.94 40.7,10.6 46.3,10.6 48.6,8.3 48.6,6.85 R8.1
P_E  (via drill 0.5)
  Top 0.305: U2.21 33.95,22.25 34.5,21.7 36.3,21.7 36.9,22.3 39.2,22.3 v40,23.1 | v48.6,17.4 R13.1
  Bottom 0.305: v40,23.1 43,23.1 v48.6,17.4
P_F  (via drill 0.5)
  Top 0.305: U2.45 42.16,24.75 45.9,21 v46.4,21 | v48.6,19.7 49.65,19.7 R14.1
  Bottom 0.305: v46.4,21 47.3,21 v48.6,19.7
P_G  (via drill 0.5)
  Top 0.305: U2.46 42.35,25.25 45.8,21.8 v47,21.8 | v48.6,21.8 R15.1
  Bottom 0.305: v47,21.8 v48.6,21.8
P_IR1  (via drill 0.5)
  Top 0.305: U2.19 34.85,23.25 v35.2,22.9 | v37.1,12.4 R22.2
  Bottom 0.305: v35.2,22.9 34.6,22.3 34.6,15.8 37.1,13.3 v37.1,12.4
P_IR2  (via drill 0.5)
  Top 0.305: U2.20 34.16,22.74 34.7,22.2 35.8,22.2 v36,22.4 | R21.2 39.7,8.6 38.5,9.8 v38.5,11.8
  Bottom 0.305: v36,22.4 35.9,22.4 35.1,21.6 35.1,16.1 38.5,12.7 v38.5,11.8
P_LED1
  Top 0.305: U2.4 38.34,28.95 39.2,29.8 43.8,29.8 48.9,34.9 49.35,34.9 R18.1 50.8,34.95 VT5.1
P_LED2
  Top 0.305: U2.3 38.85,28.75 39.4,29.3 47.4,29.3 48.9,30.8 49.35,30.8 R16.1 | 49.1,30.9 49.35,30.9 R16.1 | R16.1 50.8,30.85 VT3.1
P_LED3
  Top 0.305: U2.2 39.36,28.56 39.6,28.8 47.35,28.8 R17.1 50.8,26.75 VT4.1
PWR_EN  (via drill 0.5)
  Top 0.305: U2.30 36.85,17.95 v36.7,17.8 | v16,22.7 16,24.29 VT2.B
  Bottom 0.305: v16,22.7 24.9,22.7 33,30.8 34.9,30.8 35.9,29.8 35.9,24.1 36.8,23.2 36.8,17.9 v36.7,17.8
SEN_1  (via drill 0.5)
  Top 0.305: U2.10 35.35,29.25 v35.1,29.5 | U3.3 33.4,13.9 v35,13.9 36.6,13.9 37.8,12.7 37.8,9.7 38.4,9.1 38.4,6.3 39.1,5.6 40.1,5.6 40.8,4.9 40.8,3.7 40.1,3 35.7,3 34.43,4.27 SV4.2
  Top 0.406: R19.2 32.4,6.26 SV4.2
  Bottom 0.305: v35.1,29.5 35.1,25.6 35.4,25.3 35.4,24.1 34.1,22.8 34.1,14.8 v35,13.9
SEN_2  (via drill 0.5)
  Top 0.305: U2.11 34.84,28.66 34.4,29.1 34.4,29.3 34.2,29.5 34.2,29.9 v34.1,30 | v26.7,15.2 U3.5 29.4,15.2 29.9,14.7 29.9,11.1 31.5,9.5 35.4,9.5 35.8,9.1 35.8,7.2 35.25,6.65 R20.2
  Top 0.406: R20.2 34.55,6.65 SV4.4
  Bottom 0.305: v34.1,30 34.1,29.6 34.4,29.3 34.4,28.7 31.8,26.1 30.8,26.1 30.3,25.6 30.3,24 31.6,22.7 31.6,15.8 31,15.2 v26.7,15.2
SWCLK  (via drill 0.5)
  Top 0.305: U2.37 41.32,20.28 v41.4,20.2 | C14.2 23.45,4.5 22,4.5 20.79,3.29 SV3.2 20.8,1.1 21.4,0.5 40.4,0.5 40.8,0.9 40.8,2.4 41.4,3 v43.7,3
  Bottom 0.305: v41.4,20.2 41.4,18.7 43.7,16.4 v43.7,3
SWDIO  (via drill 0.5)
  Top 0.305: U2.34 38.8,19.23 38.8,17.6 v39.5,16.9
  Bottom 0.305: SV3.4 25.87,1.13 26.5,0.5 29,0.5 29.7,1.2 29.7,4.9 33.7,8.9 37.7,8.9 39.7,10.9 39.7,16.7 v39.5,16.9
SWO  (via drill 0.5)
  Top 0.305: U2.39 40.45,21.75 40.1,22.1 v40,22.1
  Bottom 0.305: v40,22.1 39.3,21.4 39.3,18.1 40.2,17.2 40.2,10.7 37.9,8.4 33.9,8.4 30.9,5.4 30.9,2.55 SV3.6
VBAT  (via drill 0.5)
  Top 0.254: U1.6 13.08,31.38 13,31.3 | U1.1 8.51,33.59 v7.8,34.3 | v13.3,29.7 C4.1
  Top 0.406: R3.2 27.4,25.87 v27.4,27.7 | v23.7,28.1 23.1,28.1 21.5,29.5 L1.P$2
  Top 0.61: C4.1 11.95,30.95 12.3,31.3 13,31.3 14.6,29.7 18.6,29.7 L1.P$2
  Top 0.813: VT1.3 11.88,29.63 C4.1
  Bottom 0.254: v7.8,34.3 8.7,34.3 v13.3,29.7
  Bottom 0.406: v27.4,27.7 27,28.1 v23.7,28.1